# Altium project VYLT_IOT_HAT_DEMO.PrjPcb
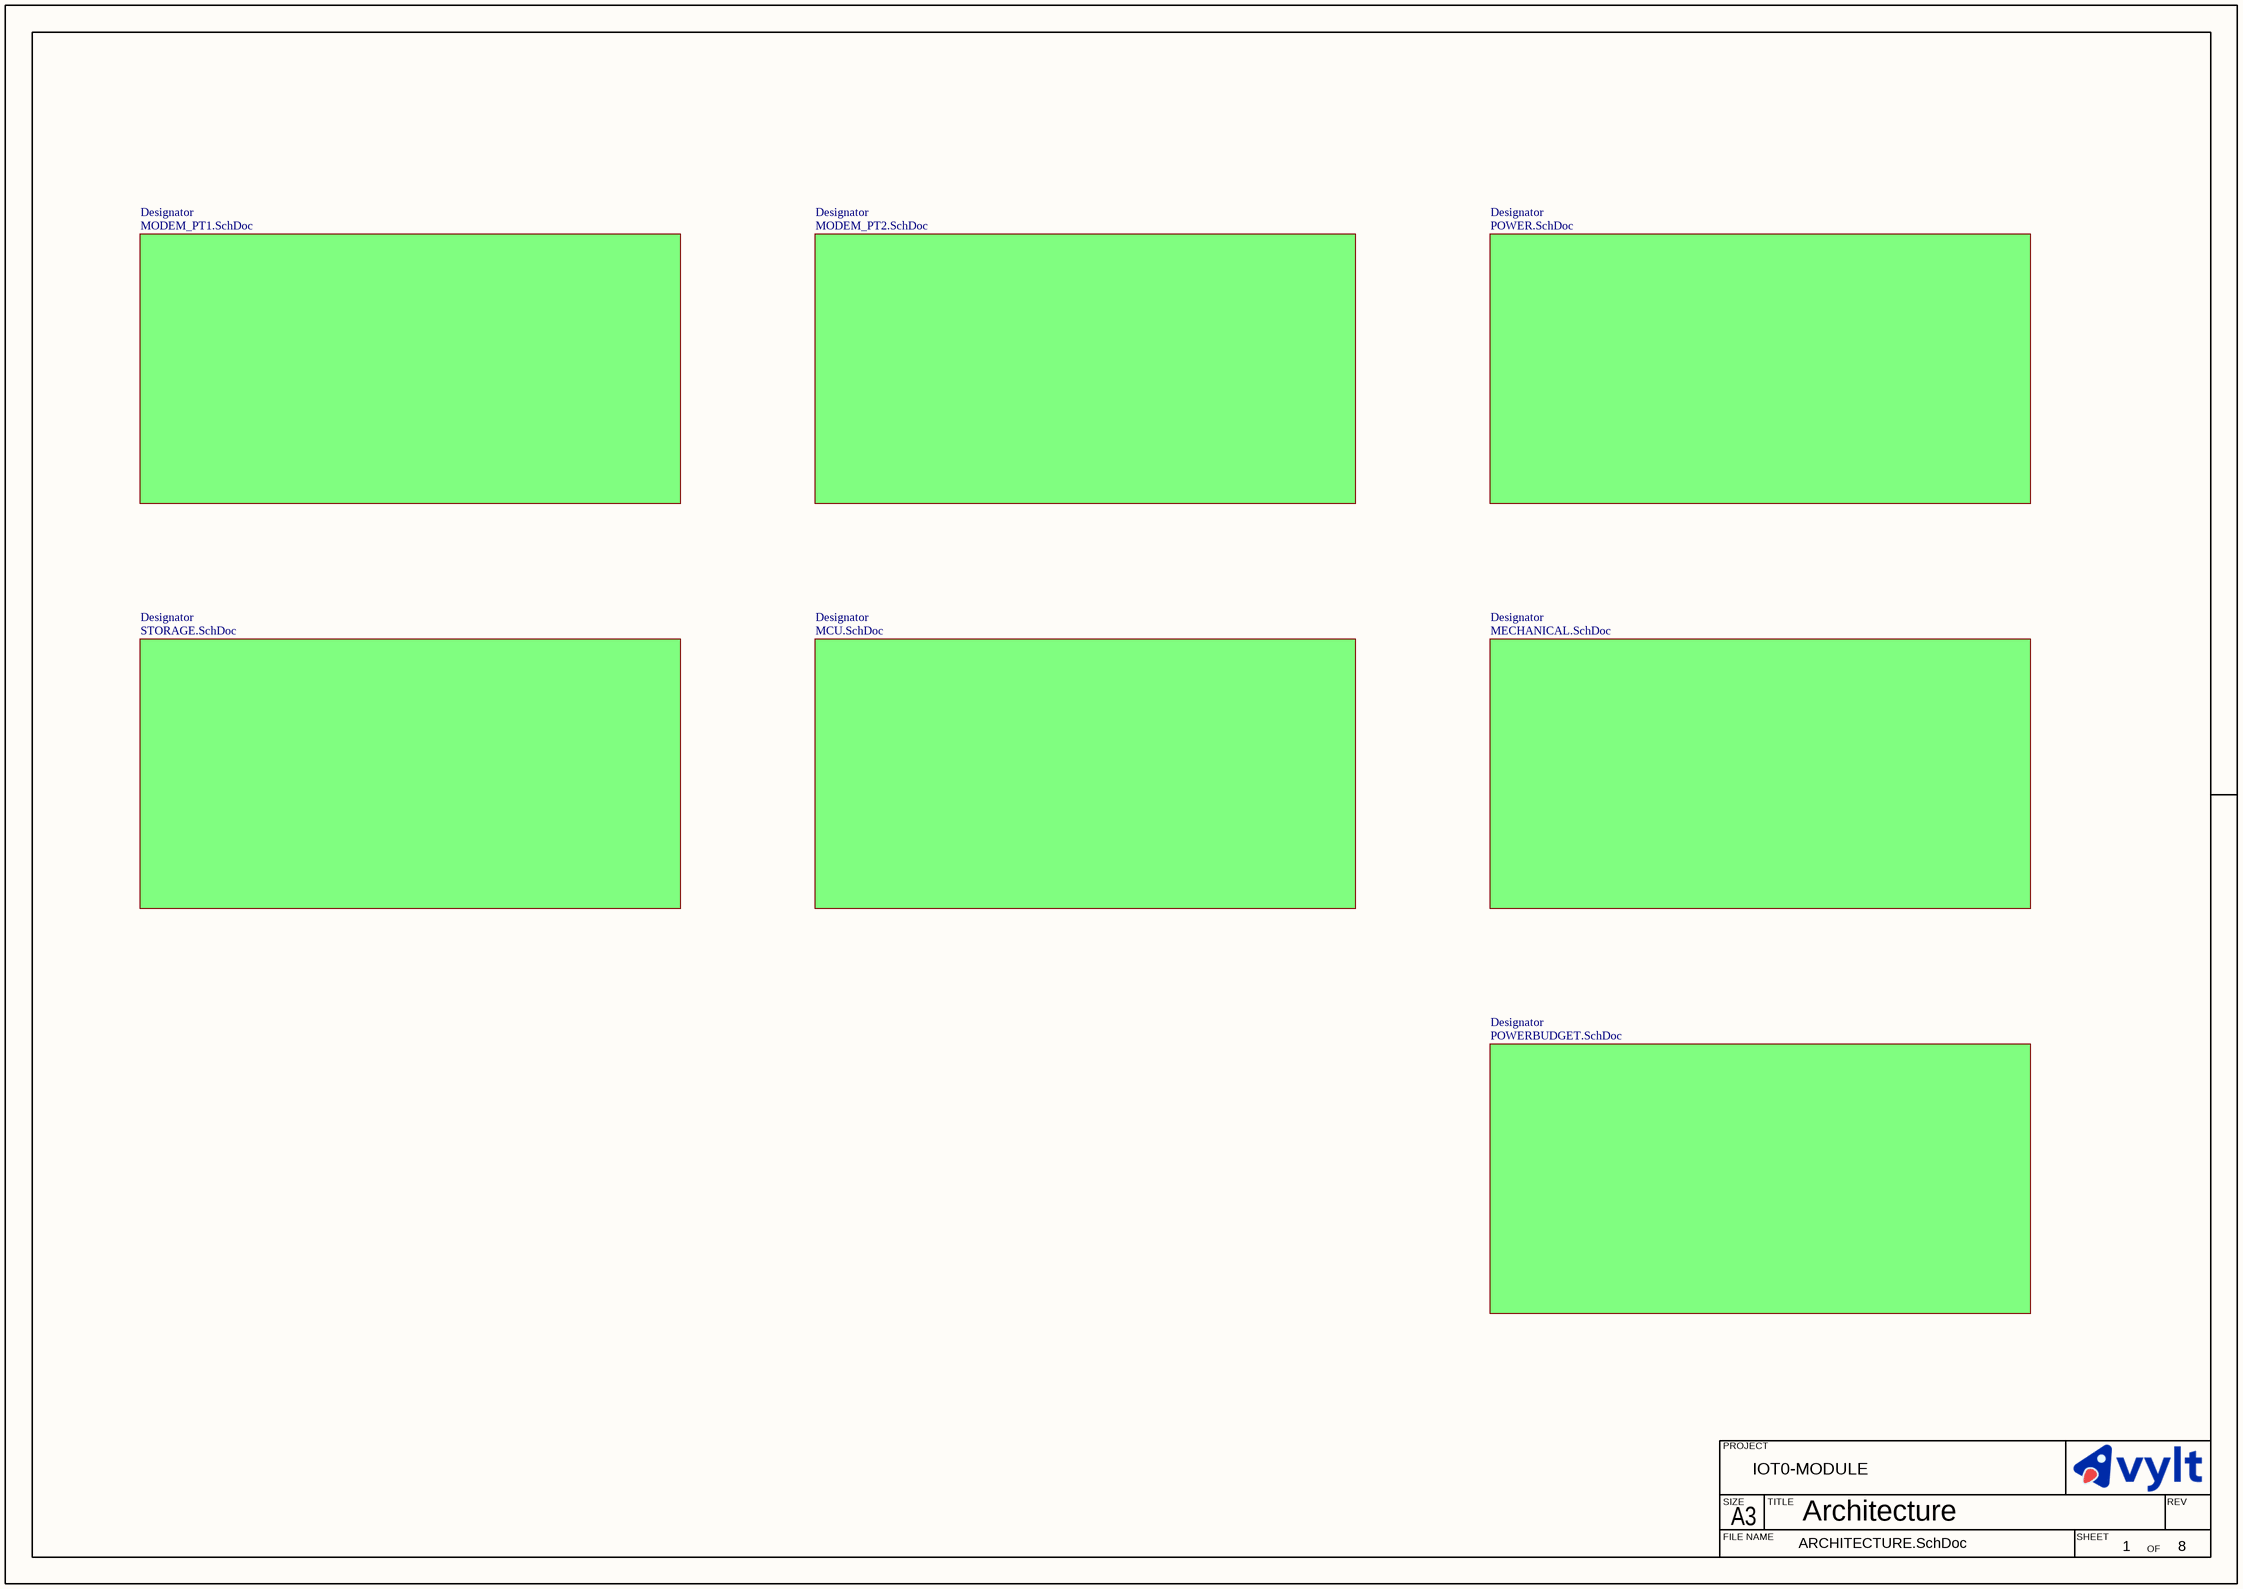
[diagram p0: ARCHITECTURE.SchDoc]
Project: IOT0-MODULE; Rev: 1.0; SheetTotal: 8
8 sheets, 6 parts. Net scope: global (net labels, ports and power ports of the same name join across sheets).
Board file: VYLT_IOT_HAT_DEMO.PcbDoc
Sheets:
  ARCHITECTURE.SchDoc
    Designator = MCU.SchDoc
    Designator = MODEM_PT2.SchDoc
    Designator = MECHANICAL.SchDoc
    Designator = STORAGE.SchDoc
    Designator = MODEM_PT1.SchDoc
    Designator = POWER.SchDoc
    Designator = POWERBUDGET.SchDoc

## Sheet ARCHITECTURE.SchDoc: Architecture
size 420 x 297 mm; Revision: 1.0; SheetNumber: 1

### Sub-sheets
Designator = MCU.SchDoc: no entries
Designator = MODEM_PT2.SchDoc: no entries
Designator = MECHANICAL.SchDoc: no entries
Designator = STORAGE.SchDoc: no entries
Designator = MODEM_PT1.SchDoc: no entries
Designator = POWER.SchDoc: no entries
Designator = POWERBUDGET.SchDoc: no entries

### Notes on the sheet
- PROJECT
- SIZE
- FILE NAME
- A3
- TITLE
- SHEET
- OF
- REV

## Sheet MCU.SchDoc: ESP32-PICO, STM32F4
size 420 x 297 mm; Revision: 1.0; SheetNumber: 6

### Notes on the sheet
- PROJECT
- SIZE
- FILE NAME
- A3
- TITLE
- SHEET
- OF
- REV

## Sheet MODEM_PT2.SchDoc: VBATT, LED, LVL SHIFT
size 420 x 297 mm; Revision: 1.0; SheetNumber: 4

### Notes on the sheet
- PROJECT
- SIZE
- FILE NAME
- A3
- TITLE
- SHEET
- OF
- REV

## Sheet MECHANICAL.SchDoc: MECHANICAL
size 420 x 297 mm; Revision: 1.0; SheetNumber: 7

### Notes on the sheet
- PROJECT
- SIZE
- FILE NAME
- A3
- TITLE
- SHEET
- OF
- REV

## Sheet STORAGE.SchDoc: FLASH, SD CARD
size 420 x 297 mm; Revision: 1.0; SheetNumber: 5

### Notes on the sheet
- PROJECT
- SIZE
- FILE NAME
- A3
- TITLE
- SHEET
- OF
- REV

## Sheet MODEM_PT1.SchDoc: EC200U, SIM, USB, ANT
size 420 x 297 mm; Revision: 1.0; SheetNumber: 3

### Notes on the sheet
- PROJECT
- SIZE
- FILE NAME
- A3
- TITLE
- SHEET
- OF
- REV

## Sheet POWER.SchDoc: Power Supply
size 420 x 297 mm; Revision: 1.0; SheetNumber: 2; SheetTotal: 10
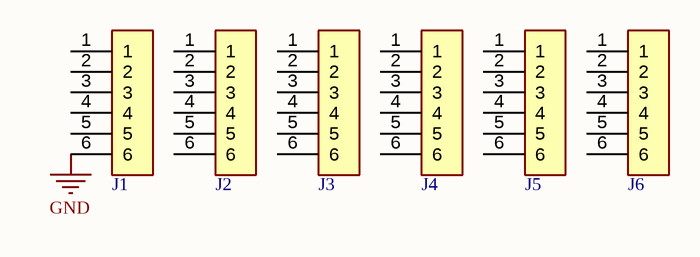
[diagram p1: POWER.SchDoc]

### Parts
J1  6PX1R_M  [6PX1R_M_STK20]  (value not drawn)
J2  6PX1R_M  [6PX1R_M_STK20]  (value not drawn)
J3  6PX1R_M  [6PX1R_M_STK20]  (value not drawn)
J4  6PX1R_M  [6PX1R_M_STK20]  (value not drawn)
J5  6PX1R_M  [6PX1R_M_STK20]  (value not drawn)
J6  6PX1R_M  [6PX1R_M_STK20]  (value not drawn)

### Nets
GND: J1.6

Not connected (* = marked no-connect by the designer): J1 1 2 3 4 5; J2 1 2 3 4 5 6; J3 1 2 3 4 5 6; J4 1 2 3 4 5 6; J5 1 2 3 4 5 6; J6 1 2 3 4 5 6

### Notes on the sheet
- PROJECT
- SIZE
- FILE NAME
- A3
- TITLE
- SHEET
- OF
- REV

### Library data of the parts
J1-J6 = 6PX1R_M: 6PX1R Male Header; Value: *; Manufacturer 1: *; Manufacturer Part Number 1: *

## Sheet POWERBUDGET.SchDoc: Power Budget
size 420 x 297 mm; Revision: 1.0; SheetNumber: 8

### Notes on the sheet
- PROJECT
- SIZE
- FILE NAME
- A3
- TITLE
- SHEET
- OF
- REV